# Altium schematic sheet ECU_Power.SchDoc
size A; SheetNumber: 3; SheetTotal: 3
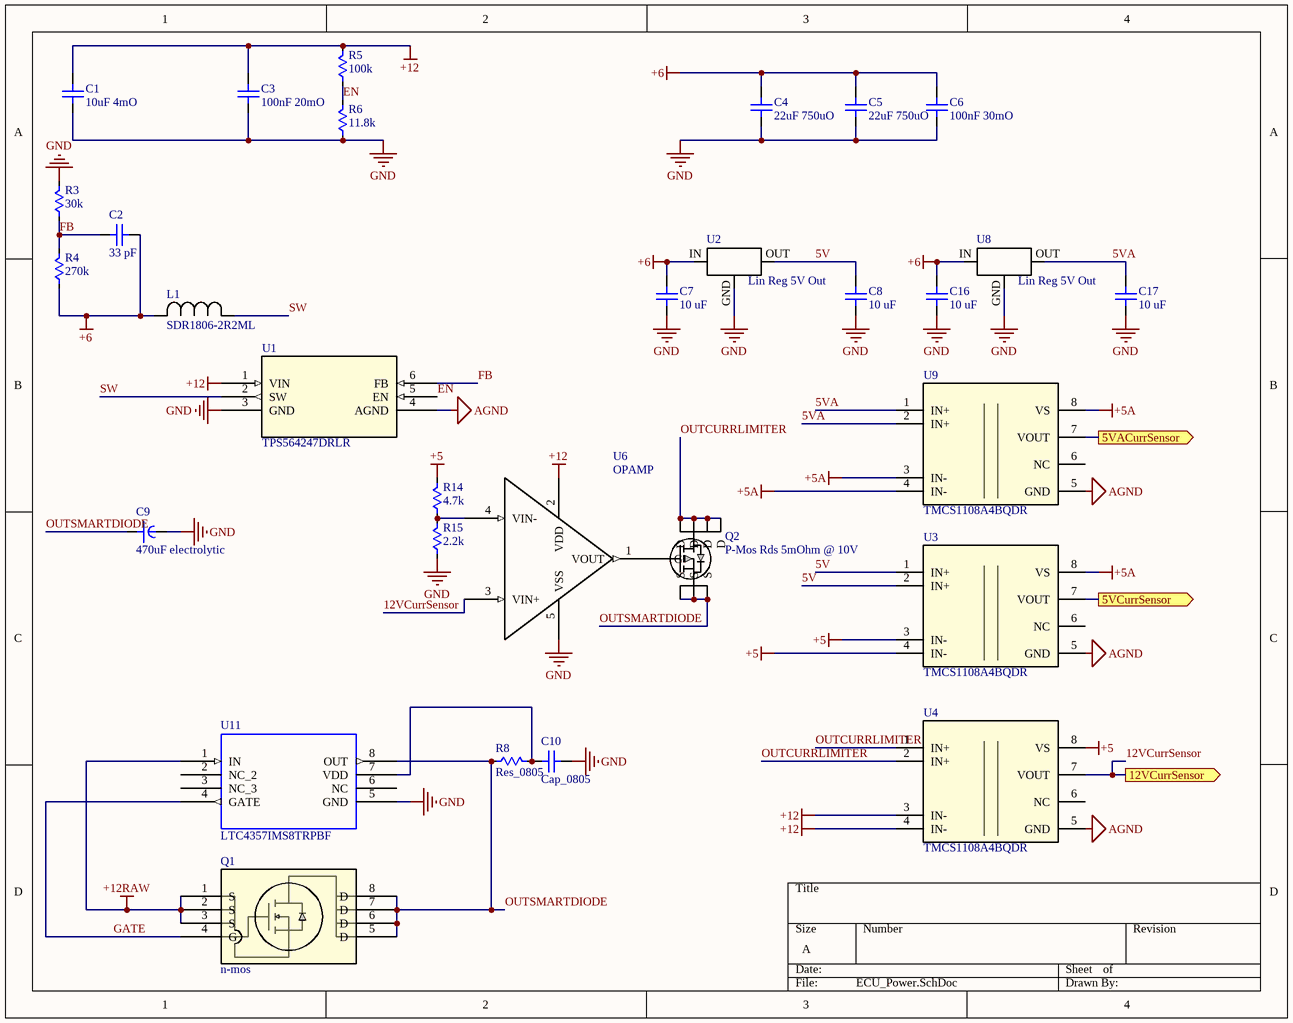
[diagram p0: ECU_Power.SchDoc]

## Parts
C1  10uF 4mO  [0805]
C2  33 pF  [0805]
C3  100nF 20mO  [0805]
C4  22uF 750uO  [0805]
C5  22uF 750uO  [0805]
C6  100nF 30mO  [0805]
C7  10 uF  [0805]
C8  10 uF  [0805]
C9  470uF electrolytic  [CAPPRD750W80D1600H2700]
C10  Cap_0805  [0805]
C16  10 uF  [0805]
C17  10 uF  [0805]
L1  SDR1806-2R2ML  [IND_BOURNS_SDR1806]
Q1  n-mos  [D0008A-IPC_A]
Q2  P-Mos Rds 5mOhm @ 10V  [D0008A-IPC_A]
R3  30k  [0805]
R4  270k  [0805]
R5  100k  [0805]
R6  11.8k  [0805]
R8  Res_0805  [0805]
R14  4.7k  [0805]
R15  2.2k  [0805]
U1  TPS564247DRLR  [SOT5x3-6_DRL_TEX]
U2  Lin Reg 5V Out  [NCP1117IDT50T4G]
U3  TMCS1108A4BQDR  [D0008A-IPC_A]
U4  TMCS1108A4BQDR  [D0008A-IPC_A]
U6  OPAMP  [SOT-23-5_MC_MCH-M]
U8  Lin Reg 5V Out  [NCP1117IDT50T4G]
U9  TMCS1108A4BQDR  [D0008A-IPC_A]
U11  LTC4357IMS8TRPBF  [MSOP-8_MS]

## Ports
5VACurrSensor (out), 5VCurrSensor (out), 12VCurrSensor (out)

## Nets
+5: R14.2 U3.3(IN-) U3.4(IN-) U4.8(VS)
+5A: U3.8(VS) U9.3(IN-) U9.4(IN-) U9.8(VS)
+6: C2.2 C4.2 C5.2 C6.2 C7.2 C16.2 L1.2 R4.1 U2.IN U8.IN
+12: C1.2 C3.2 R5.2 U1.1(VIN) U4.3(IN-) U4.4(IN-) U6.2(VDD)
+12RAW: Q1.1(S) Q1.2(S) Q1.3(S) U11.1(IN)
AGND: U1.4(AGND) U3.5(GND) U4.5(GND) U9.5(GND)
GND: C1.1 C3.1 C4.1 C5.1 C6.1 C7.1 C8.1 C9.2 C10.2 C16.1 C17.1 R3.2 R6.1 R15.1 U1.3(GND) U2.GND U6.5(VSS) U8.GND U11.5(GND)
5V: C8.2 U2.OUT U3.1(IN+) U3.2(IN+)
5VA: C17.2 U8.OUT U9.1(IN+) U9.2(IN+)
5VACurrSensor: U9.7(VOUT) ; port 5VACurrSensor
5VCurrSensor: U3.7(VOUT) ; port 5VCurrSensor
12VCurrSensor: U4.7(VOUT) U6.3(VIN+) ; port 12VCurrSensor
EN: R5.1 R6.2 U1.5(EN)
FB: C2.1 R3.1 R4.2 U1.6(FB)
GATE: Q1.4(G) U11.4(GATE)
OUTCURRLIMITER: Q2.5(D) Q2.6(D) Q2.7(D) Q2.8(D) U4.1(IN+) U4.2(IN+)
OUTSMARTDIODE: C9.1 Q1.5(D) Q1.6(D) Q1.7(D) Q1.8(D) Q2.1(S) Q2.2(S) Q2.3(S) R8.1 U11.8(OUT)
SW: L1.1 U1.2(SW)
NetC10_1: C10.1 R8.2 U11.7(VDD)
NetQ2_4: Q2.4(G) U6.1(VOUT)
NetR14_1: R14.1 R15.2 U6.4(VIN-)

Not connected (* = marked no-connect by the designer): U3 6(NC); U4 6(NC); U9 6(NC); U11 2(NC_2) 3(NC_3) 6(NC)

## Library data of the parts
C1 C3-C8 C10 C16 C17 = Cap_0805: Cap 0805
C2 = Cap_0805: Cap 0805 - 33 pF, 1mOhm
C9 = CAPPRD750W80D1600H2700: 470 µF 100 V Aluminum Electrolytic Capacitors Radial, Can 282mOhm @ 120Hz 2000 Hrs @ 85°C
L1 = SDR1806-2R2ML: No Description Available; Mfr_Name: Bourns Electronics; Type: DEV; Copyright: Copyright (C) 2022 Ultra Librarian. All rights reserved.; Manufacturer_Part_Number: SDR1806-2R2ML; RefDes: RefDes
Q1 = DMN3007LSSQ-13: MOSFET MOSFETBVDSS: 25V-30V
Q2 = UPA2735GR-E1-AT: P-Channel 30 V 16A (Ta) 2.5W (Ta) Surface Mount 8-SOP; Mfr_Name: Renesas Electronics; Type: DEV; Copyright: Copyright (C) 2022 Ultra Librarian. All rights reserved.; Manufacturer_Part_Number: UPA2735GR-E1-AT; RefDes: RefDes
R3 = Res_0805: Res 0805 - 30kOhm
R4 = Res_0805: Res 0805 - 270kOhm
R5 R6 R8 R14 R15 = Res_0805: Res 0805
U1 = TPS564247DRLR: No Description Available; Mfr_Name: Texas Instruments; Copyright: Copyright (C) 2022 Ultra Librarian. All rights reserved.; Manufacturer_Part_Number: TPS564247DRLR; RefDes: RefDes; Type: DEV
U2 U8 = NCP1117IDT50T4G: Linear Voltage Regulator IC Positive Fixed 1 Output 1A DPAK
U3 U4 U9 = TMCS1108A4BQDR: No Description Available; Mfr_Name: Texas Instruments; Type: DEV; RefDes: RefDes; Copyright: Copyright (C) 2022 Ultra Librarian. All rights reserved.; Manufacturer_Part_Number: TMCS1108A4BQDR
U6 = MCP6486T-EOT: Operational Amplifiers - Op Amps Single, 10MHz Op Amp, E Temp; Mfr_Name: Microchip; Copyright: Copyright (C) 2022 Ultra Librarian. All rights reserved.; Manufacturer_Part_Number: MCP6486T-EOT; RefDes: RefDes; Type: DEV
U11 = LTC4357IMS8TRPBF: OR Controller N+1 ORing Controller N-Channel N:1 8-MSOP; MF: Analog Devices; MP: LTC4357IMS8#TRPBF; Value: *; Package: MSOP-8 Analog Devices; Price: None; Availability: Unavailable; SnapEDA_Link: https://www.snapeda.com/parts/LTC4357IMS8%23TRPBF/Analog%20Devices/view-part/4335178/?ref=snap